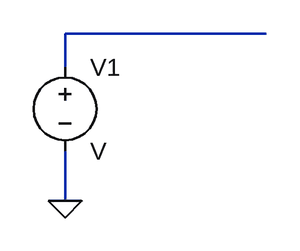
[diagram p0: schematic GenericDCMotorSimulation.asc]
GenericDCMotorSimulation.asc, the LTspice schematic file:
Version 4
SHEET 1 880 680
WIRE 144 96 -48 96
WIRE -48 128 -48 96
WIRE -48 256 -48 208
FLAG -48 256 0
SYMBOL voltage -48 112 R0
SYMATTR InstName V1

The netlist it stands for:
* GenericDCMotorSimulation.asc
V1 N001 0 V
.backanno
.end